# Altium schematic sheet KSIMU.SchDoc
size 292 x 193 mm
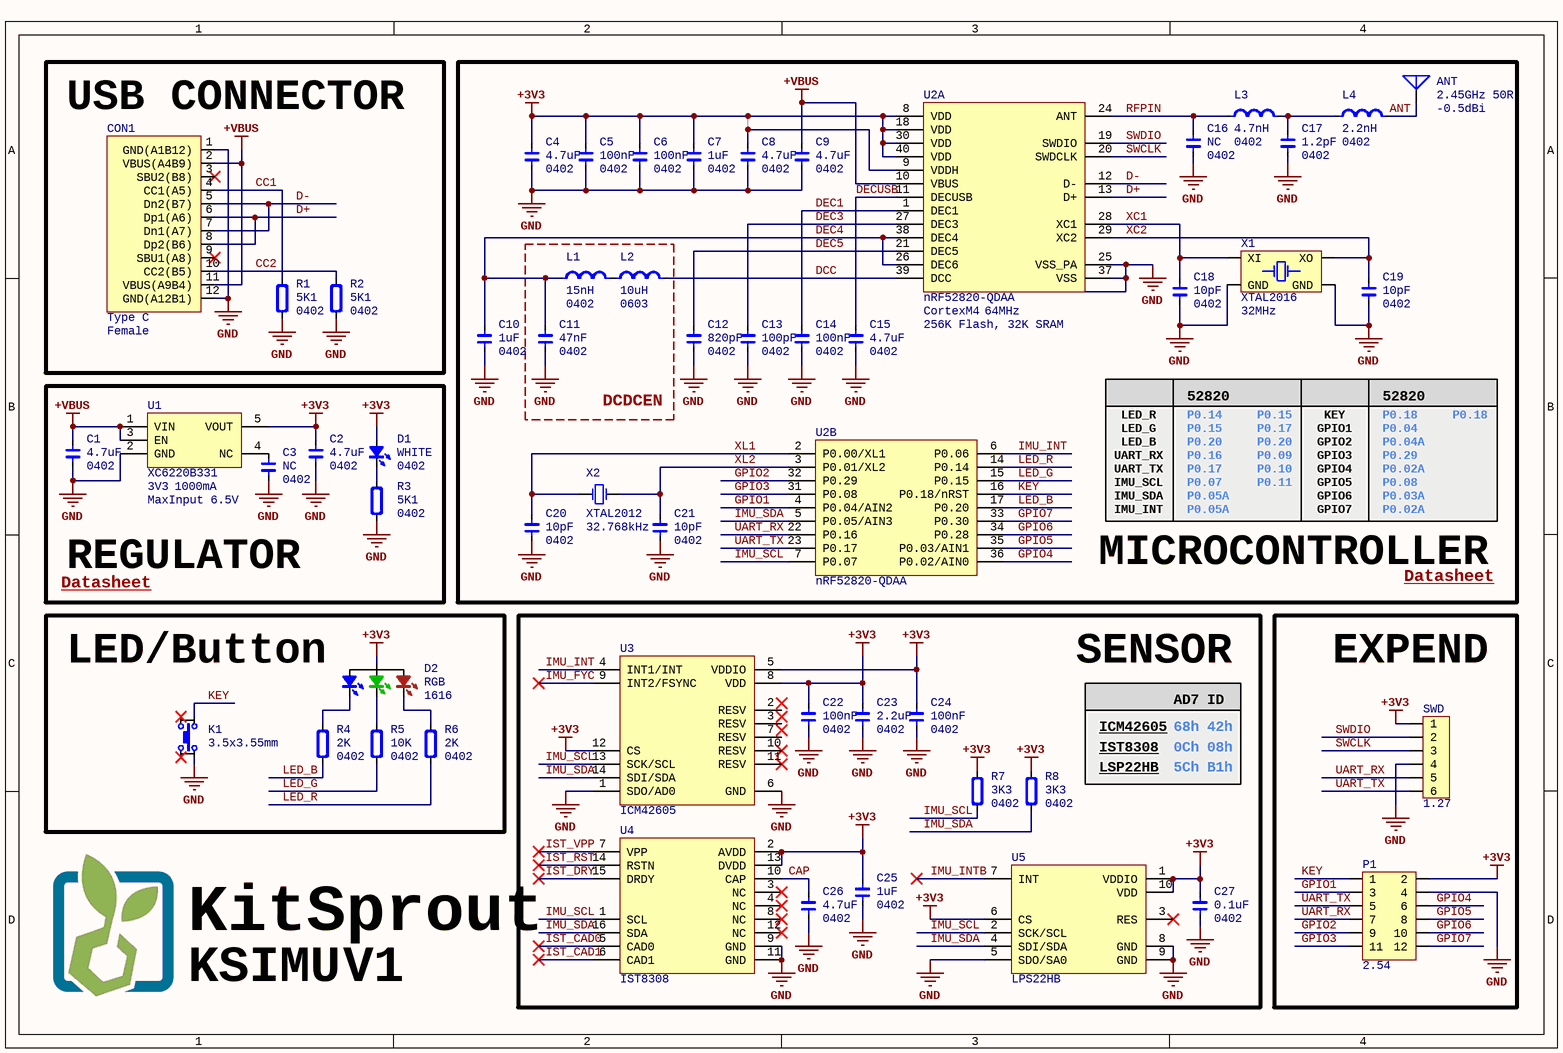
[diagram p0: KSIMU.SchDoc]

## Parts
ANT  value -0.5dBi  Specification: 2.45GHz 50R  [ANT_2.4G_3.2x1.6]  (hidden comment: 2450AT18B100E)
C1  value 4.7uF  Type: 0402  [CAP_0402]  (hidden comment: C0402)
C2  value 4.7uF  Type: 0402  [CAP_0402]  (hidden comment: C0402)
C3  value NC  Type: 0402  [CAP_0402]  (hidden comment: C0402)
C4  value 4.7uF  Type: 0402  [CAP_0402]  (hidden comment: C0402)
C5  value 100nF  Type: 0402  [CAP_0402]  (hidden comment: C0402)
C6  value 100nF  Type: 0402  [CAP_0402]  (hidden comment: C0402)
C7  value 1uF  Type: 0402  [CAP_0402]  (hidden comment: C0402)
C8  value 4.7uF  Type: 0402  [CAP_0402]  (hidden comment: C0402)
C9  value 4.7uF  Type: 0402  [CAP_0402]  (hidden comment: C0402)
C10  value 1uF  Type: 0402  [CAP_0402]  (hidden comment: C0402)
C11  value 47nF  Type: 0402  [CAP_0402]  (hidden comment: C0402)
C12  value 820pF  Type: 0402  [CAP_0402]  (hidden comment: C0402)
C13  value 100pF  Type: 0402  [CAP_0402]  (hidden comment: C0402)
C14  value 100nF  Type: 0402  [CAP_0402]  (hidden comment: C0402)
C15  value 4.7uF  Type: 0402  [CAP_0402]  (hidden comment: C0402)
C16  value NC  Type: 0402  [CAP_0402]  (hidden comment: C0402)
C17  value 1.2pF  Type: 0402  [CAP_0402]  (hidden comment: C0402)
C18  value 10pF  Type: 0402  [CAP_0402]  (hidden comment: C0402)
C19  value 10pF  Type: 0402  [CAP_0402]  (hidden comment: C0402)
C20  value 10pF  Type: 0402  [CAP_0402]  (hidden comment: C0402)
C21  value 10pF  Type: 0402  [CAP_0402]  (hidden comment: C0402)
C22  value 100nF  Type: 0402  [CAP_0402]  (hidden comment: C0402)
C23  value 2.2uF  Type: 0402  [CAP_0402]  (hidden comment: C0402)
C24  value 100nF  Type: 0402  [CAP_0402]  (hidden comment: C0402)
C25  value 1uF  Type: 0402  [CAP_0402]  (hidden comment: C0402)
C26  value 4.7uF  Type: 0402  [CAP_0402]  (hidden comment: C0402)
C27  value 0.1uF  Type: 0402  [CAP_0402]  (hidden comment: C0402)
CON1  value Type C  Type: Female  [USB_TypeC_16P]  (hidden comment: USB Type C)
D1  value WHITE  Type: 0402  [LED_0402_YELLOW]  (hidden comment: D0402)
D2  value RGB  Type: 1616  [LED_1616_RGB]  (hidden comment: D1616)
K1  Specification: 3.5x3.55mm  [Button_TACT_90_4P_3.5x3.55_H]  (hidden comment: TACT)
L1  value 15nH  Type: 0402  [IND_0402]  (hidden comment: H0402)
L2  value 10uH  Type: 0603  [IND_0603]  (hidden comment: H0603)
L3  value 4.7nH  Type: 0402  [IND_0402]  (hidden comment: H0402)
L4  value 2.2nH  Type: 0402  [IND_0402]  (hidden comment: H0402)
P1  value 2.54  [HDR2X6_2.54_180]  (hidden comment: HDR2x6)
R1  value 5K1  Type: 0402  [RES_0402]  (hidden comment: R0402)
R2  value 5K1  Type: 0402  [RES_0402]  (hidden comment: R0402)
R3  value 5K1  Type: 0402  [RES_0402]  (hidden comment: R0402)
R4  value 2K  Type: 0402  [RES_0402]  (hidden comment: R0402)
R5  value 10K  Type: 0402  [RES_0402]  (hidden comment: R0402)
R6  value 2K  Type: 0402  [RES_0402]  (hidden comment: R0402)
R7  value 3K3  Type: 0402  [RES_0402]  (hidden comment: R0402)
R8  value 3K3  Type: 0402  [RES_0402]  (hidden comment: R0402)
SWD  value 1.27  [HDR1X6_1.27_180F]  (hidden comment: HDR1x6)
U1  XC6220B331  value 3V3  Specification: 1000mA  Note: MaxInput 6.5V  [SOT23-5]
U2  nRF52820-QDAA  value 64MHz  Note: CortexM4  Specification: 256K Flash, 32K SRAM  [QFN40_P0.4_5.0x5.0_H]  (parts A,B of 2)
U3  ICM42605  [ICMx_LGA14_P0.5_2.5x3.0]
U4  IST8308  [ISTX_LGA16_P0.5_3.0x3.0]
U5  LPS22HB  [LPSx_LGA10_P0.5_2.0x2.0]
X1  XTAL2016  value 32MHz  [XT_2016_4]
X2  XTAL2012  value 32.768kHz  [XT_2012_2]

## Blocks framed on the sheet
USB CONNECTOR: CON1 R1 R2
MICROCONTROLLER: ANT C4-C10 C12-C21 L3 L4 U2 X1 X2
DCDCEN: C11 L1 L2
REGULATOR: C1-C3 D1 R3 U1
LED/Button: D2 K1 R4-R6
SENSOR: C22-C27 R7 R8 U3-U5
EXPEND: P1 SWD

## Nets
+3V3: C2.2 C4.2 C5.2 C6.2 C7.2 C8.2 C22.2 C23.2 C24.2 C25.2 C27.2 D1.1(ANODE) D2.3(ANODE) P1.2 R7.2 R8.2 SWD.1 U1.5(VOUT) U2.8(VDD) U2.9(VDDH) U2.18(VDD) U2.30(VDD) U2.40(VDD) U3.5(VDDIO) U3.8(VDD) U3.12(CS) U4.2(AVDD) U4.13(DVDD) U5.1(VDDIO) U5.6(CS) U5.10(VDD)
+VBUS: C1.2 C9.2 CON1.2(VBUS(A4B9)) CON1.11(VBUS(A9B4)) U1.1(VIN) U1.3(EN) U2.10(VBUS)
GND: C1.1 C2.1 C3.1 C4.1 C5.1 C6.1 C7.1 C8.1 C9.1 C10.1 C11.1 C12.1 C13.1 C14.1 C15.1 C16.1 C17.1 C18.1 C19.1 C20.1 C21.1 C22.1 C23.1 C24.1 C25.1 C26.1 C27.1 CON1.1(GND(A1B12)) CON1.12(GND(A12B1)) K1.4 P1.4 R1.1 R2.1 R3.1 SWD.4 U1.2(GND) U2.25(VSS_PA) U2.37(VSS) U2.41(PAD) U3.1(SDO/AD0) U3.6(GND) U4.9(GND) U4.11(GND) U5.5(SDO/SA0) U5.8(GND) U5.9(GND) X1.2(GND) X1.4(GND)
ANT: ANT.1(A) L4.2
CAP: C26.2 U4.10(CAP)
CC1: CON1.4(CC1(A5)) R1.2
CC2: CON1.10(CC2(B5)) R2.2
D+: CON1.6(Dp1(A6)) CON1.8(Dp2(B6)) U2.13(D+)
D-: CON1.5(Dn2(B7)) CON1.7(Dn1(A7)) U2.12(D-)
DCC: L2.2 U2.39(DCC)
DEC1: C14.2 U2.1(DEC1)
DEC3: C13.2 U2.27(DEC3)
DEC4: C10.2 C11.2 L1.1 U2.26(DEC6) U2.38(DEC4)
DEC5: C12.2 U2.21(DEC5)
DECUSB: C15.2 U2.11(DECUSB)
GPIO1: P1.3 U2.4(P0.04/AIN2)
GPIO2: P1.9 U2.32(P0.29)
GPIO3: P1.11 U2.31(P0.08)
GPIO4: P1.6 U2.36(P0.02/AIN0)
GPIO5: P1.8 U2.35(P0.03/AIN1)
GPIO6: P1.10 U2.34(P0.28)
GPIO7: P1.12 U2.33(P0.30)
IMU_FYC: U3.9(INT2/FSYNC)
IMU_INT: U2.6(P0.06) U3.4(INT1/INT)
IMU_INTB: U5.7(INT)
IMU_SCL: R7.1 U2.7(P0.07) U3.13(SCK/SCL) U4.1(SCL) U5.2(SCK/SCL)
IMU_SDA: R8.1 U2.5(P0.05/AIN3) U3.14(SDI/SDA) U4.16(SDA) U5.4(SDI/SDA)
IST_CAD0: U4.5(CAD0)
IST_CAD1: U4.6(CAD1)
IST_DRY: U4.15(DRDY)
IST_RST: U4.14(RSTN)
IST_VPP: U4.7(VPP)
KEY: K1.3 P1.1 U2.16(P0.18/nRST)
LED_B: R4.1 U2.17(P0.20)
LED_G: R5.1 U2.15(P0.15)
LED_R: R6.1 U2.14(P0.14)
RFPIN: C16.2 L3.1 U2.24(ANT)
SWCLK: SWD.3 U2.20(SWDCLK)
SWDIO: SWD.2 U2.19(SWDIO)
UART_RX: P1.7 SWD.5 U2.22(P0.16)
UART_TX: P1.5 SWD.6 U2.23(P0.17)
XC1: C18.2 U2.28(XC1) X1.1(XI)
XC2: C19.2 U2.29(XC2) X1.3(XO)
XL1: C20.2 U2.2(P0.00/XL1) X2.1(OSC1)
XL2: C21.2 U2.3(P0.01/XL2) X2.2(OSC2)
NetC3_2: C3.2 U1.4(NC)
NetC17_2: C17.2 L3.2 L4.1
NetD1_2: D1.2(CATHODE) R3.2
NetD2_1: D2.1(CATHODE) R5.2
NetD2_2: D2.2(CATHODE) R4.2
NetD2_4: D2.4(CATHODE) R6.2
NetL1_2: L1.2 L2.1

Not connected (* = marked no-connect by the designer): CON1 3(SBU2(B8))* 9(SBU1(A8))* SH; K1 1* 2*; U3 2(RESV) 3(RESV) 7(RESV) 10(RESV)* 11(RESV)*; U4 3(NC)* 4(NC)* 8(NC)* 12(NC)*; U5 3(RES)*

## Notes on the sheet
- 52820   52833
- LED_R
  LED_G
  LED_B
  UART_RX
  UART_TX
  IMU_SCL
  IMU_SDA
  IMU_INT
- P0.14     P0.15
  P0.15     P0.17
  P0.20     P0.20
  P0.16     P0.09
  P0.17     P0.10
  P0.07     P0.11
  P0.05A    P0.05A
  P0.06     P0.09
- KEY
  GPIO1
  GPIO2
  GPIO3
  GPIO4
  GPIO5
  GPIO6
  GPIO7
- P0.18     P0.18
  P0.04     P0.04A
  P0.29     P0.02A
  P0.08     P0.03A
  P0.02A    P0.31A
  P0.03A    P0.30A
  P0.28     P0.29A
  P0.30     P0.28A
- Datasheet <https://www.torexsemi.com/products/single-type-voltage-regulators/series/?name=xc6220>
- Datasheet <https://www.nordicsemi.com/Products/Low-power-short-range-wireless/nRF52820>
- ICM42605 <https://invensense.tdk.com/products/motion-tracking/6-axis/icm-42688-p/>
- IST8308 <http://www.isentek.com/zhtw/the_product.php?pid=4>
- 68h
- 0Ch
- AD7
- 42h
- 08h
- ID
- LSP22HB <https://www.st.com/en/mems-and-sensors/lps22hb.html>
- 5Ch
- B1h
- KitSprout
- KSIMU
- V1
- Title
- Size:
- Date:
- A4
- Number:
- Time:
- Revision:
- Sheet
- of
- File:

## Library data of the parts
ANT = ANT_2.4G: Antenna; type: 3.2x1.6mm
C1-C27 = Cap_0402: Capacitor; Specification: X7R, 16V; Note: ±10%; Manufacturer: *; Link: *
CON1 = USB_TypeC_16P_A: USB TypeC; Link: *; Manufacturer: *; Datasheet: *; Note: *
D1 = LED_0402: LED; Manufacturer: *; Specification: *; Note: *; Link: *
D2 = LED_1616_RGB: LED; Manufacturer: *; Specification: *; Note: *; Link: *
K1 = Button_TACT_90_4P_3.5×3.55: Button; Manufacturer: Alps Alpine; Value: 4P; Type: TACT; Link: https://www.mouser.tw/ProductDetail/?qs=6EGMNY9ZYDQWpz3nhZNkIQ%3D%3D; Datasheet: https://tech.alpsalpine.com/prod/e/html/tact/surfacemount/sksc/sksclde010.html; Note: *
L1 L3 L4 = Ind_0402: Inductor; Specification: High frequency chip inductor; Note: ±5%; Manufacturer: *; Link: *
L2 = Ind_0603: Inductor; Specification: High frequency chip inductor; Note: ±5%; Manufacturer: *; Link: *
P1 = HDR2x6_2.54: Header; Note: 2x6; Type: DIP
R1-R8 = Res_0402: Resistor; Specification: 1/16W; Note: ±1%; Manufacturer: *; Link: *
SWD = HDR1x6_1.27: Header; Note: 1x6; Type: DIP
U1 = XC6220x_SOT25: LDO; Manufacturer: Torex Semiconductor; Type: SOT23-5; Datasheet: https://www.torexsemi.com/file/xc6220/XC6220.pdf; Link: https://www.torexsemi.com/products/single-type-voltage-regulators/series/?name=xc6220
U2 = nRF52820-QDAA: MCU Nordic; Manufacturer: Nordic Semiconductor; Type: QFN40 P0.4; Datasheet: https://infocenter.nordicsemi.com/index.jsp?topic=%2Fps_nrf52833%2Fkeyfeatures_html5.html; Link: https://www.nordicsemi.com/Products/Low-power-short-range-wireless/nRF52820
U3 = ICM42605: Motion Sensor; Manufacturer: TDK InvenSense; Specification: 2.5x3.0x0.91 mm; Type: LGA14 P0.5; Note: *; Value: *; Datasheet: http://invensense.tdk.com/wp-content/uploads/2020/09/DS-000292-ICM-42605-v1.5.pdf; Link: https://invensense.tdk.com/products/motion-tracking/6-axis/icm-42605/
U4 = IST8308: Magnetometer Sensor; Manufacturer: iSentek; Specification: 3.0x3.0x1.0 mm; Type: LGA16 P0.5; Note: *; Value: *; Datasheet: http://www.isentek.com/zhtw/the_product.php?pid=4; Link: http://www.isentek.com/zhtw/the_product.php?pid=4
U5 = LPS22HB: Pressure Sensor; Manufacturer: STMicroelectronics; Specification: 2.0x2.0x0.76 mm; Type: LGA10 P0.5; Note: *; Value: *; Datasheet: https://www.st.com/resource/en/datasheet/lps22hb.pdf; Link: https://www.st.com/content/st_com/en/products/mems-and-sensors/pressure-sensors/lps22hb.html
X1 = XTAL_2016_4P: Crystal Oscillator; Specification: ±10ppm; Type: XTAL2016_4P; Manufacturer: *; Note: *; Link: *
X2 = XTAL_32.768k_2P: Crystal Oscillator; Specification: ±10ppm; Type: XTAL2012_2P; Manufacturer: *; Note: *; Link: *